# Altium schematic sheet FSK_Receiver.SchDoc
size A4
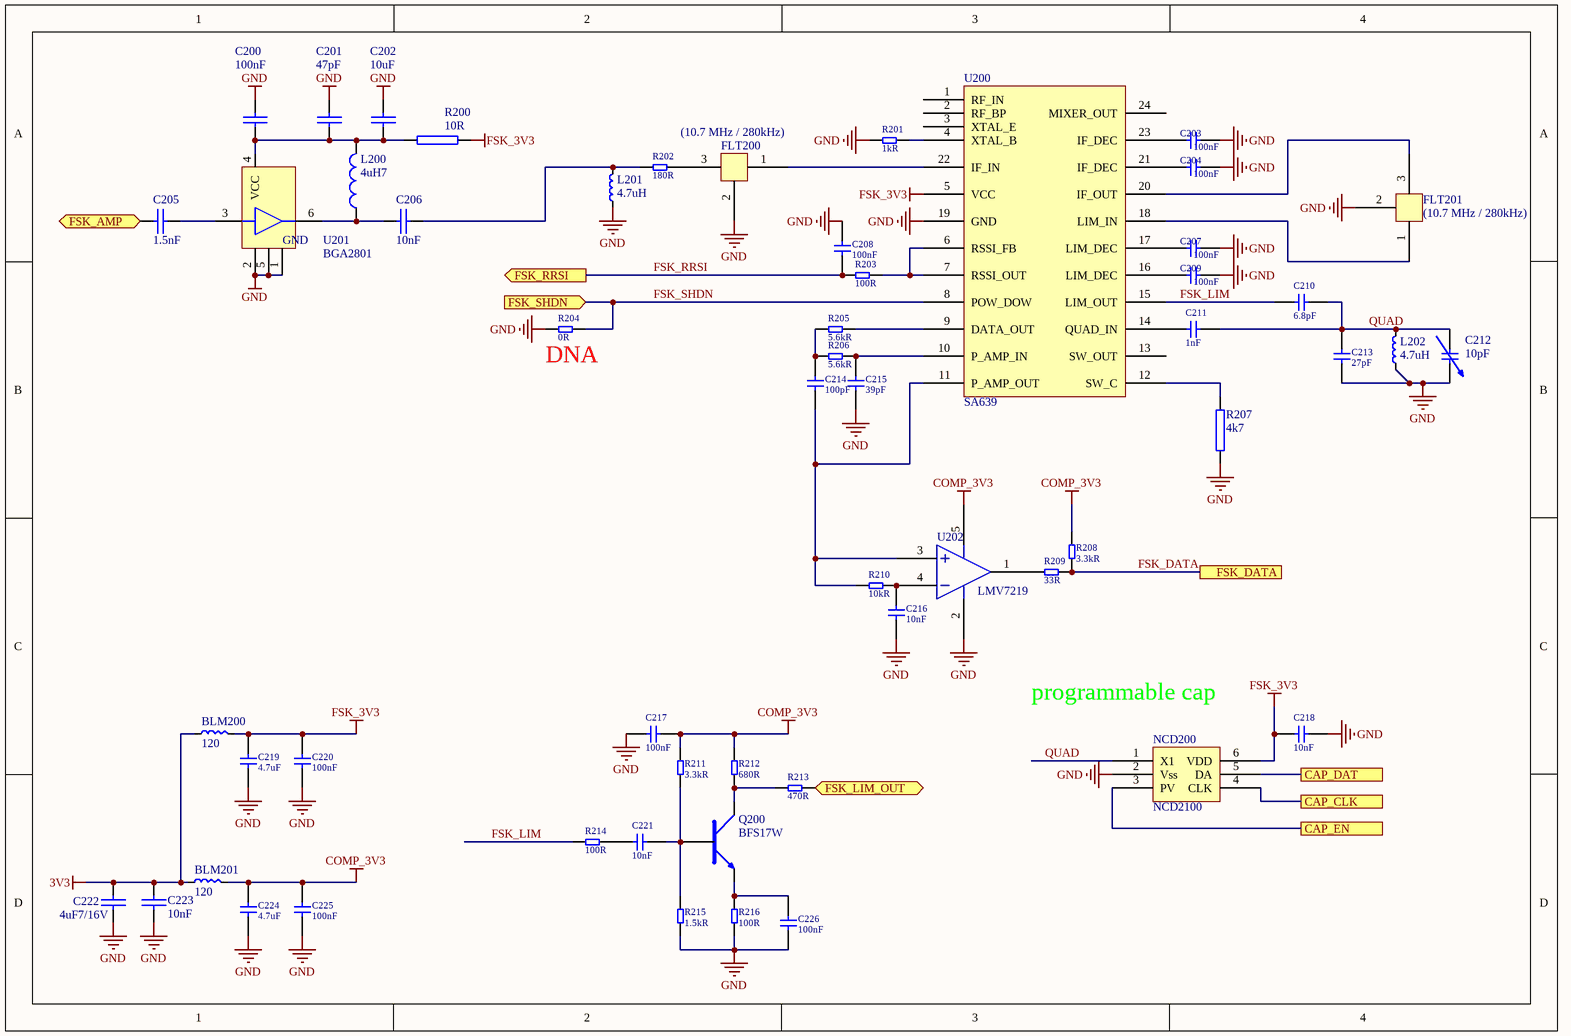
[diagram p0: FSK_Receiver.SchDoc]

## Parts
BLM200  FerriteBeat  [BLM18SG121TN1]  (value not drawn)
BLM201  FerriteBeat  [BLM18SG121TN1]  (value not drawn)
C200  100nF  [0402RN]
C201  47pF  [0402RN]
C202  10uF  [0603R]
C203  value 100nF  [C_SMD_0402]  (hidden comment: SMD capacitor)
C204  value 100nF  [C_SMD_0402]  (hidden comment: SMD capacitor)
C205  1.5nF  [0402RN]
C206  10nF  [0402RN]
C207  value 100nF  [C_SMD_0402]  (hidden comment: SMD capacitor)
C208  value 100nF  [C_SMD_0402]  (hidden comment: SMD capacitor)
C209  value 100nF  [C_SMD_0402]  (hidden comment: SMD capacitor)
C210  value 6.8pF  [C_SMD_0402]  (hidden comment: SMD capacitor)
C211  value 1nF  [C_SMD_0402]  (hidden comment: SMD capacitor)
C212  10pF  [TZC03]
C213  value 27pF  [C_SMD_0402]  (hidden comment: SMD capacitor)
C214  value 100pF  [C_SMD_0402]  (hidden comment: SMD capacitor)
C215  value 39pF  [C_SMD_0402]  (hidden comment: SMD capacitor)
C216  value 10nF  [C_SMD_0402]  (hidden comment: SMD capacitor)
C217  value 100nF  [C_SMD_0402]  (hidden comment: SMD capacitor)
C218  value 10nF  [C_SMD_0402]  (hidden comment: SMD capacitor)
C219  value 4.7uF  [C_SMD_0603]  (hidden comment: SMD capacitor)
C220  value 100nF  [C_SMD_0402]  (hidden comment: SMD capacitor)
C221  value 10nF  [C_SMD_0402]  (hidden comment: SMD capacitor)
C222  4uF7/16V  [1206R]
C223  10nF  [0402RN]
C224  value 4.7uF  [C_SMD_0603]  (hidden comment: SMD capacitor)
C225  value 100nF  [C_SMD_0402]  (hidden comment: SMD capacitor)
C226  value 100nF  [C_SMD_0402]  (hidden comment: SMD capacitor)
FLT200  (10.7 MHz / 280kHz)  [Cerafil_10.7MHz_Filter]
FLT201  (10.7 MHz / 280kHz)  [Cerafil_10.7MHz_Filter]
L200  4uH7  [0805R]
L201  4.7uH  [WE-MI SMD Multilayer Inductor]
L202  4.7uH  [WE-MI SMD Multilayer Inductor]
NCD200  (no value)  [PCBComponent_1]
Q200  BFS17W  [SOT-323]
R200  10R  [0402RN]
R201  value 1kR  [R_SMD_0402]  (hidden comment: SMD Resistor)
R202  value 180R  [R_SMD_0402]  (hidden comment: SMD Resistor)
R203  value 100R  [R_SMD_0402]  (hidden comment: SMD Resistor)
R204  value 0R  [R_SMD_0402]  (hidden comment: SMD Resistor)
R205  value 5.6kR  [R_SMD_0402]  (hidden comment: SMD Resistor)
R206  value 5.6kR  [R_SMD_0402]  (hidden comment: SMD Resistor)
R207  4k7  [0402RN]
R208  value 3.3kR  [R_SMD_0402]  (hidden comment: SMD Resistor)
R209  value 33R  [R_SMD_0402]  (hidden comment: SMD Resistor)
R210  value 10kR  [R_SMD_0402]  (hidden comment: SMD Resistor)
R211  value 3.3kR  [R_SMD_0402]  (hidden comment: SMD Resistor)
R212  value 680R  [R_SMD_0402]  (hidden comment: SMD Resistor)
R213  value 470R  [R_SMD_0402]  (hidden comment: SMD Resistor)
R214  value 100R  [R_SMD_0402]  (hidden comment: SMD Resistor)
R215  value 1.5kR  [R_SMD_0402]  (hidden comment: SMD Resistor)
R216  value 100R  [R_SMD_0402]  (hidden comment: SMD Resistor)
U200  SA639  [TSSOP24]
U201  BGA2801  [SOT-363]
U202  LMV7219  [SOT-23-5]

## Ports
CAP_CLK, CAP_DAT, CAP_EN, FSK_AMP (bidir), FSK_DATA, FSK_LIM_OUT (bidir), FSK_RRSI (out), FSK_SHDN (in)

## Nets
3V3: BLM200.2 BLM201.2 C222.1 C223.1
COMP_3V3: BLM201.1 C217.2 C224.1 C225.1 R208.1 R211.1 R212.1 U202.5
FSK_3V3: BLM200.1 C218.2 C219.1 C220.1 NCD200.6(VDD) R200.2 U200.5(VCC)
GND: C200.2 C201.2 C202.1 C203.2 C204.2 C207.2 C208.1 C209.2 C212.2 C213.1 C215.2 C216.2 C217.1 C218.1 C219.2 C220.2 C222.2 C223.2 C224.2 C225.2 C226.2 FLT200.2 FLT201.2 L201.2 L202.2 NCD200.2(Vss) R201.2 R204.2 R207.1 R215.2 R216.2 U200.19(GND) U201.1 U201.2 U201.5 U202.2
CAP_CLK: NCD200.4(CLK) ; port CAP_CLK
CAP_DAT: NCD200.5(DA) ; port CAP_DAT
CAP_EN: NCD200.3(PV) ; port CAP_EN
FSK_AMP: C205.2 ; port FSK_AMP
FSK_DATA: R208.2 R209.1 ; port FSK_DATA
FSK_LIM: C210.1 R214.2 U200.15(LIM_OUT)
FSK_LIM_OUT: R213.2 ; port FSK_LIM_OUT
FSK_RRSI: C208.2 R203.2 ; port FSK_RRSI
FSK_SHDN: R204.1 U200.8(POW_DOW) ; port FSK_SHDN
QUAD: C210.2 C211.2 C212.1 C213.2 L202.1 NCD200.1(X1)
NetC200_1: C200.1 C201.1 C202.2 L200.2 R200.1 U201.4(VCC)
NetC203_1: C203.1 U200.23(IF_DEC)
NetC204_1: C204.1 U200.21(IF_DEC)
NetC205_1: C205.1 U201.3
NetC206_1: C206.1 L200.1 U201.6
NetC206_2: C206.2 L201.1 R202.2
NetC207_1: C207.1 U200.17(LIM_DEC)
NetC209_1: C209.1 U200.16(LIM_DEC)
NetC211_1: C211.1 U200.14(QUAD_IN)
NetC214_1: C214.1 R205.2 R206.2
NetC214_2: C214.2 R210.2 U200.11(P_AMP_OUT) U202.3
NetC215_1: C215.1 R206.1 U200.10(P_AMP_IN)
NetC216_1: C216.1 R210.1 U202.4
NetC221_1: C221.1 R214.1
NetC221_2: C221.2 Q200.1(B) R211.2 R215.1
NetC226_1: C226.1 Q200.2(E) R216.1
NetFLT200_1: FLT200.1 U200.22(IF_IN)
NetFLT200_3: FLT200.3 R202.1
NetFLT201_1: FLT201.1 U200.18(LIM_IN)
NetFLT201_3: FLT201.3 U200.20(IF_OUT)
NetQ200_3: Q200.3(C) R212.2 R213.1
NetR201_1: R201.1 U200.4(XTAL_B)
NetR203_1: R203.1 U200.6(RSSI_FB) U200.7(RSSI_OUT)
NetR205_1: R205.1 U200.9(DATA_OUT)
NetR207_2: R207.2 U200.12(SW_C)
NetR209_2: R209.2 U202.1

Not connected (* = marked no-connect by the designer): U200 1(RF_IN) 2(RF_BP) 3(XTAL_E) 13(SW_OUT) 24(MIXER_OUT)

## Notes on the sheet
- (near R204) DNA
- programmable cap
- (in symbol ABA-32563) GND
- (in symbol FerriteBeat) 120

## Library data of the parts
BLM200 BLM201 = FerriteBeat: BLM18SG121TN1; Link: http://www.murata.com/en-us/api/pdfdownloadapi?cate=luNoiseSupprFilteChipFerriBead&partno=BLM18SG121TN1%23
C200 C201 C205 C206 = _C
C202 = 10u, 0603, 16V, X5R, 20%: MLCC, X5R, 16V, 20%, 0603; Libary Name: _CAP.Schlib; Hersteller: Murata; Bauteilenummer: GRM188R61C106MA73D; Bauteilalternative: with same specifications; Typ: Kondensator Keramik MDK; FIT: 2; Eingetragen von: MK; Part Number: 10u, 0603, 16V, X5R, 20%; Footprint Name: 0603R.PcbLib; Footprint: 0603; quantity Multiplier: 1; Source: SN29500-4, Tabelle 1; Distributor1: Digikey; Teilenummer Distributor1: 490-7201-1-ND; Preis @100 Distributor1: 0,1562
C203 C204 C207-C209 C217 C220 C225 C226 = C_SMD: 100nF, 0402, 6.3V, 10%, X5R; Type: X5R; Voltage Rate: *
C210 = C_SMD: 6.8pF, 0402, 6.3V, 10%, X5R; Type: X5R; Voltage Rate: *
C211 = C_SMD: 1nF, 0402, 6.3V, 10%, X5R; Type: X5R; Voltage Rate: *
C212 = TZC03R100A110
C213 = C_SMD: 28pF, 0402, 6.3V, 1%, X5R; Type: X5R; Voltage Rate: *
C214 = C_SMD: 100pF, 0402, 6.3V, 10%, X5R; Type: X5R; Voltage Rate: *
C215 = C_SMD: 39pF, 0402, 6.3V, 10%, X5R; Type: X5R; Voltage Rate: *
C216 C218 C221 = C_SMD: 10nF, 0402, 6.3V, 10%, X5R; Type: X5R; Voltage Rate: *
C219 C224 = C_SMD: 4.7uF, 0603, 6.3V, 10%, X5R; Type: X5R; Voltage Rate: *
C222 = 4u7, 1206, 16V, X7R: MLCC, 1206, X7R, 16V, 20%; Libary Name: _CAP.Schlib; Hersteller: TDK; Bauteilenummer: C3216X7R1C475M/1.60; Bauteilalternative: with same specifications; DatenblattLink intern: O:\literature\datasheets\tdk\kondensator\general_A11.pdf; Part Number: 4u7, 1206, 16V, X7R; Footprint Name: 1206R.PcbLib; Footprint: 1206; quantity Multiplier: 1; HelpURL: http://www.tdk.com/pdf/general_A11.pdf; DatenblattLink: http://www.tdk.com/pdf/general_A11.pdf; Distributor1: Digikey; Teilenummer Distributor1: 445-1425-1-ND; Preis @100 Distributor1: 0,1195; Distributor2: mouser; Teilenummer Distributor2: 810-C3216X7R1C475M-6; Preis @100 Distributor2: 0,112; Distributor3: Farnell; Teilenummer Distributor3: 1844320; Preis @100 Distributor3: 0,074
C223 = 10n, 0402, 50V, X7R: MLCC, X7R, 50V, 10%, 0402; Libary Name: _CAP.Schlib; Bauteilalternative: with same specifications; Part Number: 10n, 0402, 50V, X7R; Footprint Name: 0402RN.PcbLib; Footprint: 0402; quantity Multiplier: 1; Distributor1: Digikey; Preis @100 Distributor1: 0,0054
FLT200 FLT201 = CERAFIL_BP_10.7MHz: Murata SFECV10M7FA00-R0
L200 = _L: Wuerth WE MI; Wuerth Nr. 7447906
L201 L202 = 7447906_L_4u7: 7447906, WE Inductor; LINK: https://katalog.we-online.de/pbs/datasheet/7447906.pdf; Value: 4.7uH
NCD200 = NCD2100: NCD2100 Non-volatile Digital Programmable Capacitor SOT23-6; Hersteller: IXYS Integrated Circuits Division; Bauteilenummer: NCD2100TTR; Supplier 1: Digi-Key; Part Number: NCD2100; quantity Multiplier: 1; HelpURL: http://www.ixysic.com/home/pdfs.nsf/www/NCD2100.pdf/$file/NCD2100.pdf; DatenblattLink: http://www.ixysic.com/home/pdfs.nsf/www/NCD2100.pdf/$file/NCD2100.pdf; Distributor1: Digikey; Teilenummer Distributor1: CLA4162-2-ND; Preis @100 Distributor1: 1,66; Distributor2: Mouser; Teilenummer Distributor2: 849-NCD2100TTR; Preis @100 Distributor2: 1,39; Distributor3: -; Teilenummer Distributor3: -; Preis @100 Distributor3: 0
Q200 = BFS17W: BFS17WH6327XTSA1
R200 = _R
R201 = R_SMD: 1kR, 0402, 1%
R202 = R_SMD: 180R. 0402, 1%
R203 R214 R216 = R_SMD: 100R, 0402, 1%
R204 = R_SMD: 0R, 0402, 1%
R205 R206 = R_SMD: 5.6kR, 0402, 1%
R207 = 4k7, 0402, 1%, 0.063W, 50V: 1%, 0.063W, 50V, 0402; Libary Name: _RES.Schlib; Part Number: 4k7, 0402, 1%, 0.063W, 50V; Footprint Name: 0402RN.Pcblib; Footprint: 0402; quantity Multiplier: 1; Distributor1: Digikey; Preis @100 Distributor1: 0,0056
R208 R211 = R_SMD: 3.3kR, 0402, 1%
R209 = R_SMD: 33R, 0402, 1%
R210 = R_SMD: 10kR, 0402, 1%
R212 = R_SMD: 680R, 0402, 1%
R213 = R_SMD: 470R, 0402, 1%
R215 = R_SMD: 1.5kR, 0402, 1%
U200 = SA639: SA639DH/01,118
U201 = ABA-32563: NXP BGA2801
U202 = LMV7219: LMV7219M5